# EasyEDA Pro project ProPrj_mykeyboard_2025-10-05.epro

# Schematic Schematic1

## Sheets
1 P1: Board Name: Board1; Create Date: 2025-10-05; Page Name: P1; Project Name: mykeyboard; Schematic Name: Schematic1; Update Date: 2025-10-05; Company: 嘉立创EDA; Page Size: A4; Version: V1.0
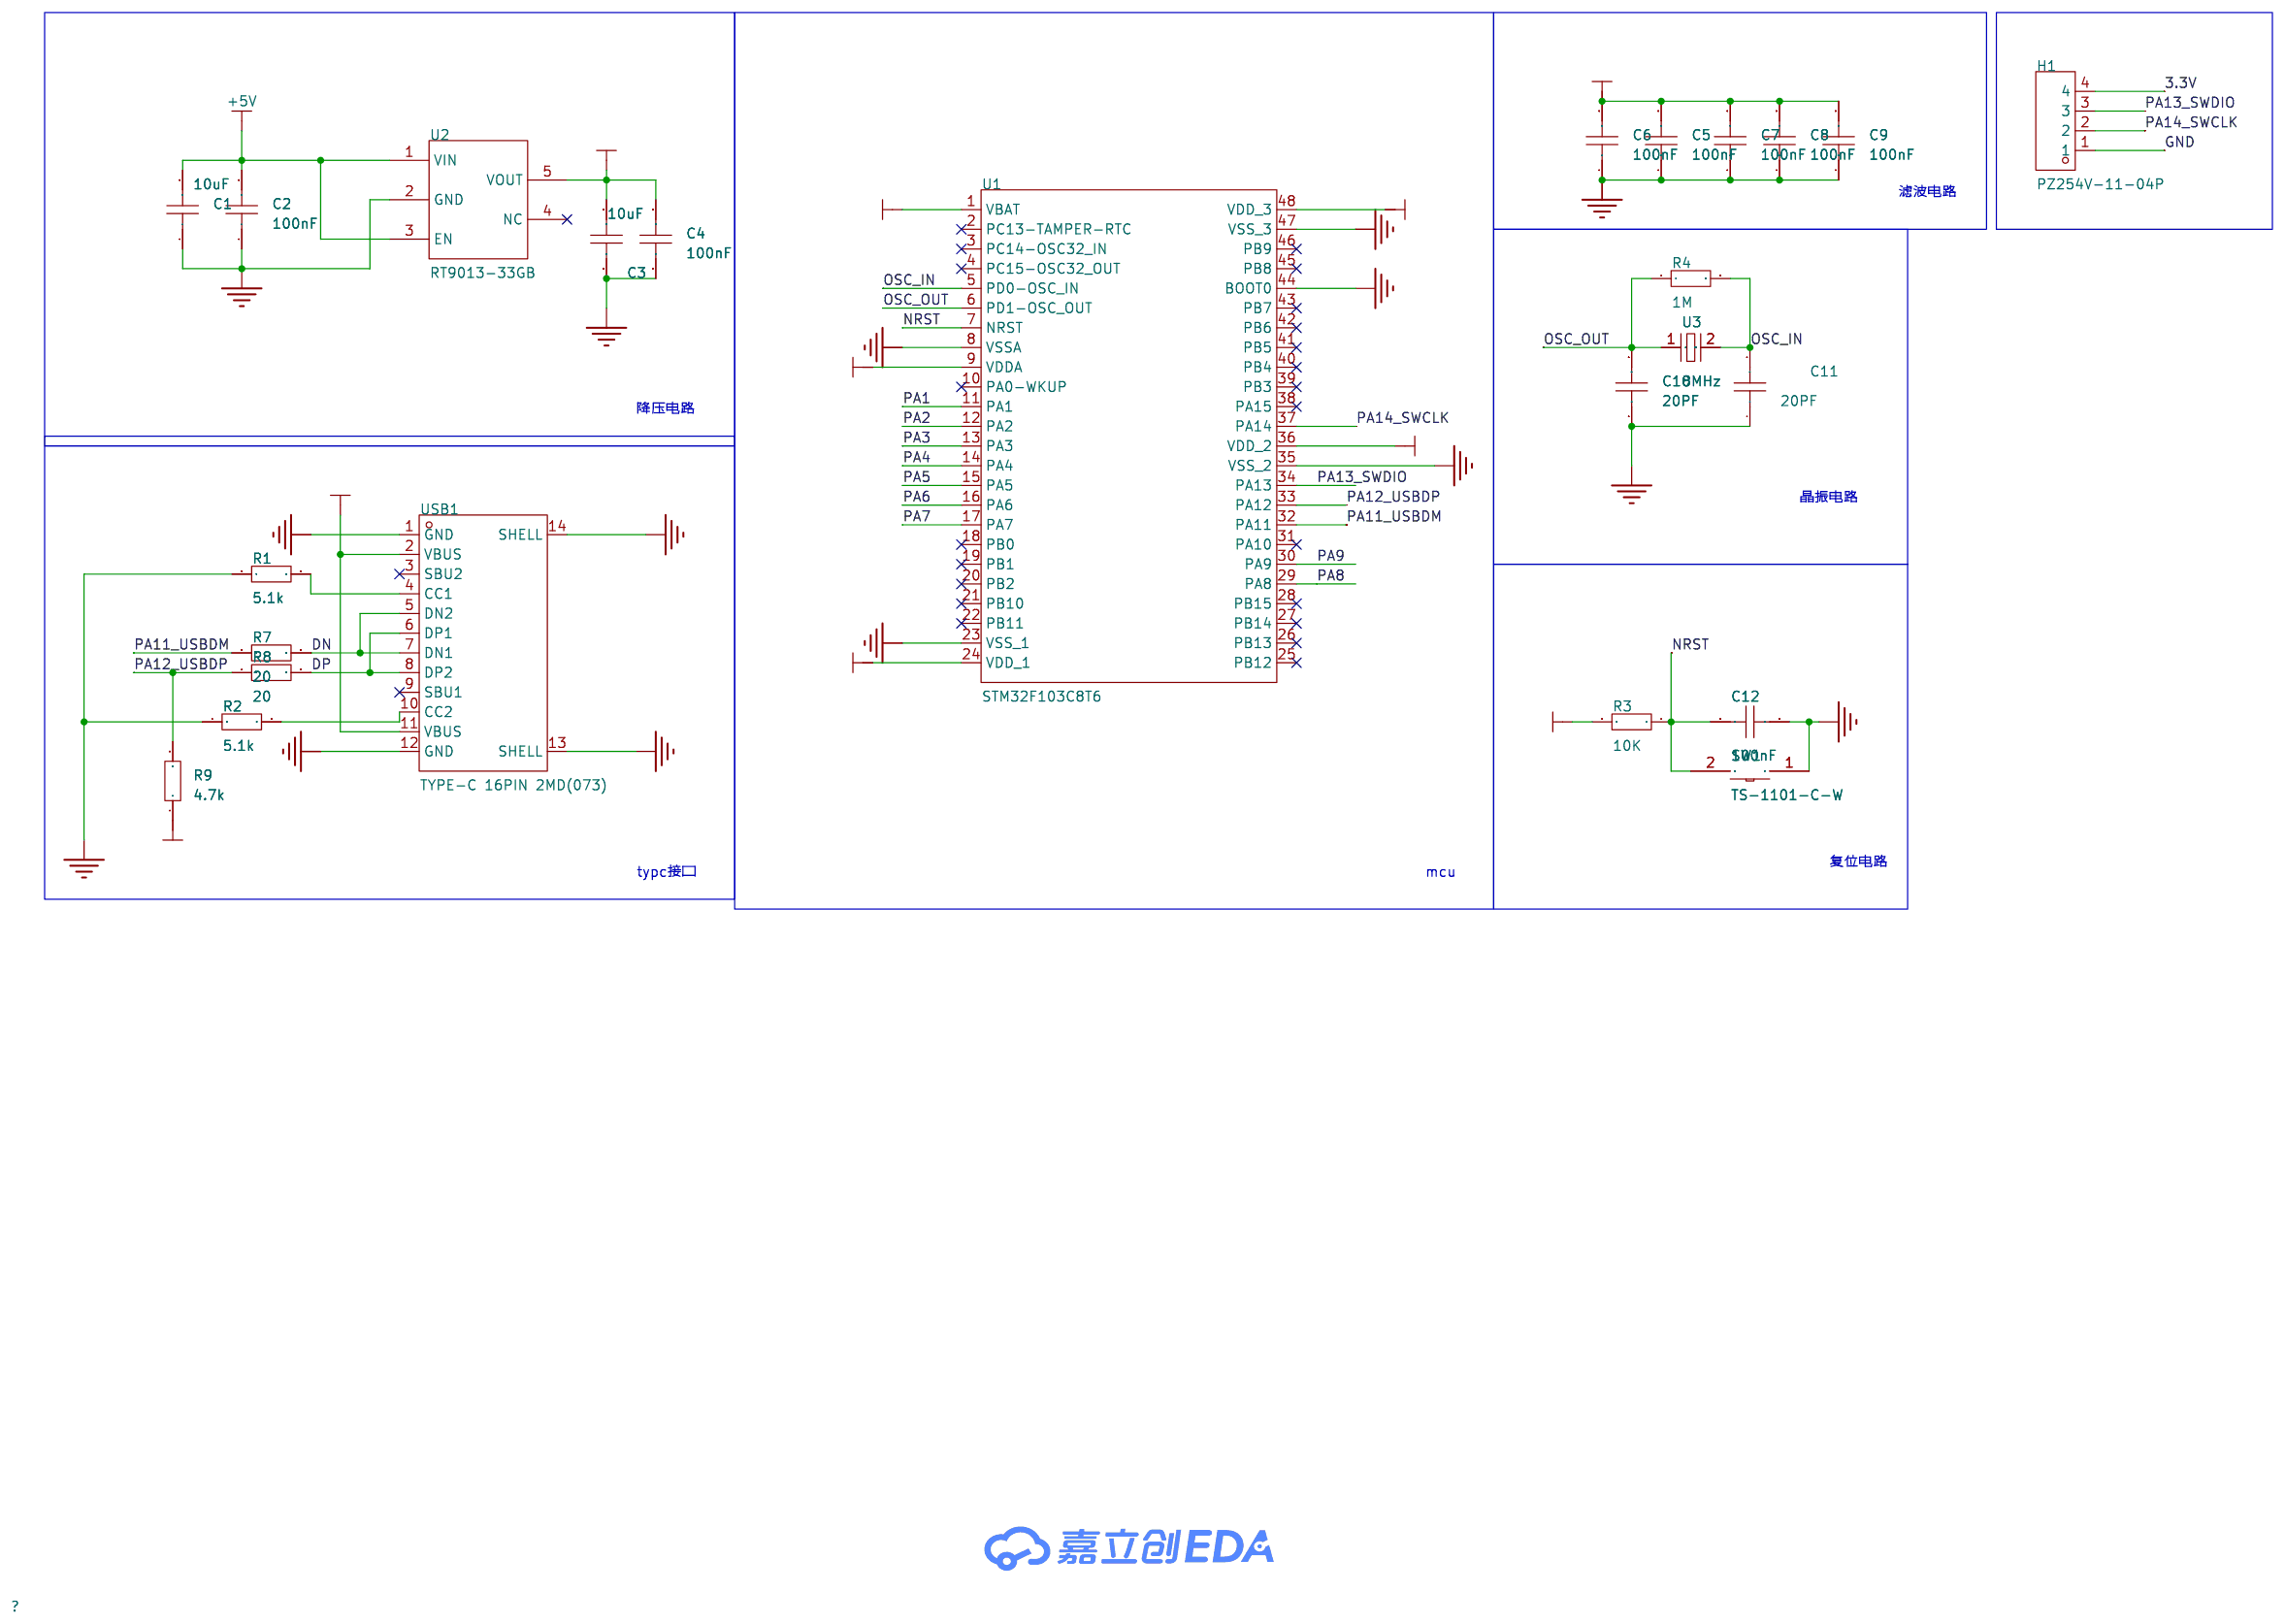
[diagram p0: P1]
2 P2: Page Name: P2
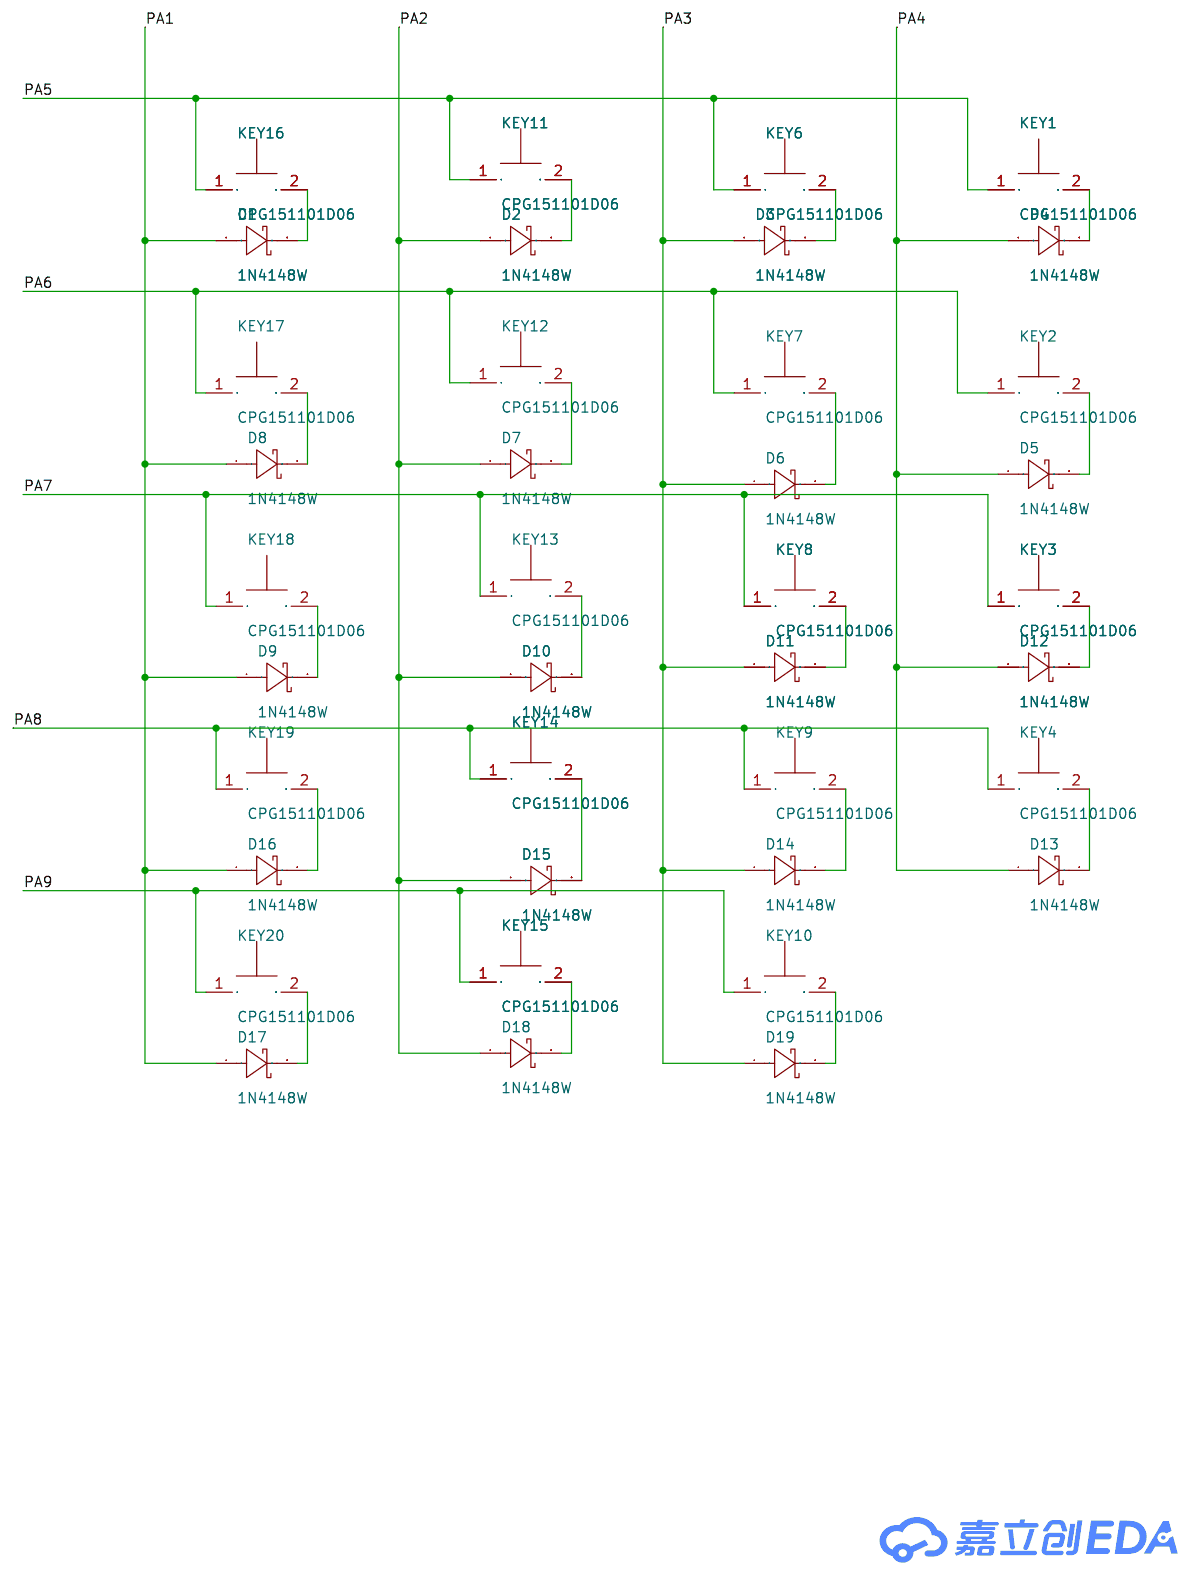
[diagram p1: P2]

## Parts
sheet P1
C1  10uF  [C0603]
C2  100nF  [C0603]
C3  10uF  [C0603]
C4  100nF  [C0603]
C5  100nF  [C0603]
C6  100nF  [C0603]
C7  100nF  [C0603]
C8  100nF  [C0603]
C9  100nF  [C0603]
C10  20PF  [C0603]
C11  20PF  [C0603]
C12  100nF  [C0603]
H1  PZ254V-11-04P  [HDR-TH_4P-P2.54-V-M]
R1  5.1k  [R0603]
R2  5.1k  [R0603]
R3  10K  [R0603]
R4  1M  [R0603]
R7  20  [R0603]
R8  20  [R0603]
R9  4.7k  [R0603]
SW1  TS-1101-C-W  [SW-SMD_L6.0-W3.3-LS8.0]
U1  STM32F103C8T6  [LQFP-48_L7.0-W7.0-P0.50-LS9.0-BL]
U2  RT9013-33GB  [SOT-23-5_L3.0-W1.7-P0.95-LS2.8-BL]
U3  8MHz  [HC-49S_L7.0-W4.0]
USB1  TYPE-C 16PIN 2MD(073)  [USB-C-SMD_TYPE-C-6PIN-2MD-073]
sheet P2
D1  1N4148W  [SOD-123_L2.7-W1.6-LS3.7-FD]
D2  1N4148W  [SOD-123_L2.7-W1.6-LS3.7-FD]
D3  1N4148W  [SOD-123_L2.7-W1.6-LS3.7-FD]
D4  1N4148W  [SOD-123_L2.7-W1.6-LS3.7-FD]
D5  1N4148W  [SOD-123_L2.7-W1.6-LS3.7-FD]
D6  1N4148W  [SOD-123_L2.7-W1.6-LS3.7-FD]
D7  1N4148W  [SOD-123_L2.7-W1.6-LS3.7-FD]
D8  1N4148W  [SOD-123_L2.7-W1.6-LS3.7-FD]
D9  1N4148W  [SOD-123_L2.7-W1.6-LS3.7-FD]
D10  1N4148W  [SOD-123_L2.7-W1.6-LS3.7-FD]
D11  1N4148W  [SOD-123_L2.7-W1.6-LS3.7-FD]
D12  1N4148W  [SOD-123_L2.7-W1.6-LS3.7-FD]
D13  1N4148W  [SOD-123_L2.7-W1.6-LS3.7-FD]
D14  1N4148W  [SOD-123_L2.7-W1.6-LS3.7-FD]
D15  1N4148W  [SOD-123_L2.7-W1.6-LS3.7-FD]
D16  1N4148W  [SOD-123_L2.7-W1.6-LS3.7-FD]
D17  1N4148W  [SOD-123_L2.7-W1.6-LS3.7-FD]
D18  1N4148W  [SOD-123_L2.7-W1.6-LS3.7-FD]
D19  1N4148W  [SOD-123_L2.7-W1.6-LS3.7-FD]
KEY1  CPG151101D06  [KEY-TH_CPG151101D06]
KEY2  CPG151101D06  [KEY-TH_CPG151101D06]
KEY3  CPG151101D06  [KEY-TH_CPG151101D06]
KEY4  CPG151101D06  [KEY-TH_CPG151101D06]
KEY6  CPG151101D06  [KEY-TH_CPG151101D06]
KEY7  CPG151101D06  [KEY-TH_CPG151101D06]
KEY8  CPG151101D06  [KEY-TH_CPG151101D06]
KEY9  CPG151101D06  [KEY-TH_CPG151101D06]
KEY10  CPG151101D06  [KEY-TH_CPG151101D06]
KEY11  CPG151101D06  [KEY-TH_CPG151101D06]
KEY12  CPG151101D06  [KEY-TH_CPG151101D06]
KEY13  CPG151101D06  [KEY-TH_CPG151101D06]
KEY14  CPG151101D06  [KEY-TH_CPG151101D06]
KEY15  CPG151101D06  [KEY-TH_CPG151101D06]
KEY16  CPG151101D06  [KEY-TH_CPG151101D06]
KEY17  CPG151101D06  [KEY-TH_CPG151101D06]
KEY18  CPG151101D06  [KEY-TH_CPG151101D06]
KEY19  CPG151101D06  [KEY-TH_CPG151101D06]
KEY20  CPG151101D06  [KEY-TH_CPG151101D06]

## Library data of the parts
C1-C12 = CAP_0603: Supplier Footprint: 0603
H1 = PZ254V-11-04P: 插针结构:1x4P;间距:2.54mm;行距:-;圆针/方针:方针;安装方式:直插;排数:单排;总PIN位数:4P;额定电流:3A;额定电压:250V;配合针长度:6mm;塑高:2.5mm;端接针长度:3mm;触头材质:-;工作温度:-40℃~+105℃;颜色:黑色;; LCSC Part Name: 1x4P 间距:2.54mm 方针 直插; Supplier Part: C2691448; Manufacturer: XFCN(兴飞); Supplier Footprint: 插件,P=2.54mm; JLCPCB Part Class: 扩展库; Datasheet: https://item.szlcsc.com/datasheet/PZ254V-11-04P/2801085.html; Supplier: LCSC; Pin Structure: 1x4P; Pitch: 2.54mm; Circluar Pins/Square Pins: 方针; Mounting Type: 直插; Number of Rows: 单排; Number of Pins: 4P; Current Rating: 3A; Voltage Rating (Max): 250V; Length of Mating Pin: 6mm; Insulation Height: 2.5mm; Length of End Connection Pin: 3mm; Operating Temperature: -40℃~+105℃; Color: 黑色
R1-R4 R7-R9 = Res_0603: Supplier Footprint: 0603
SW1 = TS-1101-C-W: 电路结构:单刀单掷;按钮形状:矩形按钮;作用力:260gf;安装方式:立贴;开关长度:6mm;开关宽度:3.6mm;开关高度:2.5mm;带支架:不带;触点电流:50mA;额定电压(AC):-;额定电压(DC):12V;额定功率:-;绝缘电阻:-;带灯:无;机械寿命:5万次;; LCSC Part Name: 6*3.6*2.5mm 立贴 轻触开关; Supplier Part: C318938; Manufacturer: XKB Connectivity(中国星坤); Supplier Footprint: SMD; JLCPCB Part Class: 扩展库; Datasheet: https://atta.szlcsc.com/upload/public/pdf/source/20200227/C318938_C2E53B1EEDE37D980A33616AC086DE53.pdf; Supplier: LCSC; Circuit: 单刀单掷; Actuator Style: 矩形按钮; Operating Force: 260gf; Mounting Style: 立贴; Switch Length: 6mm; Switch Width: 3.6mm; Switch Height: 2.5mm; Strike Gundam: 不带; Contact Current: 50mA; Voltage Rating (DC): 12V; Actuator/Cap Color: 白色带淡绿; With Lamp: 无; Mechanical Life: 5万次; Operating Temperature: -30℃~+85℃
U1 = STM32F103C8T6: CPU内核:ARM-M3;CPU最大主频:72MHz;应用领域:-;; LCSC Part Name: 主流增强型ARM Cortex-M3 MCU，具有64 KB Flash、72 MHz CPU、电机控制、USB和CAN; Supplier Part: C8734; Manufacturer: ST(意法半导体); Supplier Footprint: LQFP-48(7x7); JLCPCB Part Class: 扩展库; Datasheet: https://item.szlcsc.com/datasheet/STM32F103C8T6/9243.html; Supplier: LCSC; CPU Core: ARM-M3; CPU Maximum Speed: 72MHz; Program Storage Size: 64KB; Program Memory Type: FLASH; Number of I/O: 37; ADC (Bit): 12bit; Voltage - Supply: 2V~3.6V
U2 = RT9013-33GB: 输出类型:固定;工作电压:5.5V;输出电压:3.3V;输出电流:500mA;电源纹波抑制比(PSRR):50dB@(10kHz);输出极性:正极;; LCSC Part Name: 输入5.5V 输出3.3V 500mA; Supplier Part: C47773; Manufacturer: RICHTEK(立锜); Supplier Footprint: SOT-23-5; JLCPCB Part Class: 扩展库; Datasheet: https://item.szlcsc.com/datasheet/RT9013-33GB/48778.html; Supplier: LCSC; Output Type: 固定; Voltage - Supply: 5.5V; Output Voltage: 3.3V; Output Current: 500mA; Power Supply Rejection Ratio (PSRR): 50dB@(10kHz); Voltage Dropout: 400mV@(500mA); standby current: 25uA; Noise: 30uVrms; Features: 带使能；过热保护；过流保护; Operating Temperature: -40℃~+125℃@(Tj); Output Configuration: 正极; Number of Outputs: 1
U3 = 8M 20PF 20PPM: 频率:8MHz;常温频差:±20ppm;负载电容:20pF;频率稳定度:±30ppm;; LCSC Part Name: 8MHz ±20ppm 20pF; Supplier Part: C5289692; Manufacturer: SOSET(索斯特); Supplier Footprint: HC-49S-SMD-Mini; JLCPCB Part Class: 扩展库; Datasheet: https://item.szlcsc.com/datasheet/8M%252020PF%252020PPM/6029008.html; Supplier: LCSC; Normal temperature Frequency Tolerance: ±20ppm; Load Capacitance: 20pF; Frequency Stability: ±30ppm; Operating Temperature: -20℃~+70℃
USB1 = TYPE-C 16PIN 2MD(073): 连接器类型:Type-C;协议标准:-;公母:母;安装方式:卧贴;触点数量:16P;端口数量:1;额定电流 - 电源:3A;工作温度:-25℃~+85℃;; LCSC Part Name: Type-C 母 卧贴; Supplier Part: C2765186; Manufacturer: SHOU HAN(首韩); Supplier Footprint: SMD; JLCPCB Part Class: 扩展库; Datasheet: https://item.szlcsc.com/datasheet/TYPE-C%252016PIN%25202MD(073)/2901843.html; Supplier: LCSC; Connector Type: Type-C; Gender: 母; Mounting Type: 卧贴; Number of Contacts: 16P; Number of Ports: 1; Current Rating-Power: 3A; Voltage Rating: 5V; Connect-Disconnect Life: 5千次; Detection color: 黑色; Operating Temperature: -25℃~+85℃
D1-D19 = 1N4148W_C7420318: 二极管配置:独立式;正向压降(Vf):1.25V@150mA;直流反向耐压(Vr):100V;整流电流:150mA;反向恢复时间(Trr):4ns;; Supplier Part: C7420318; Manufacturer: R+O(宏嘉诚); Supplier Footprint: SOD-123; JLCPCB Part Class: 扩展库; Datasheet: https://item.szlcsc.com/datasheet/1N4148W/8397140.html; Supplier: LCSC; Diode Configuration: 独立式; Voltage - Forward(Vf@If): 1.25V@150mA; Voltage - DC Reverse(Vr): 100V; Current - Rectified: 150mA; Pd - Power Dissipation: 400mW; Reverse Leakage Current (Ir): 1uA@75V; Reverse Recovery Time (trr): 4ns; Operating Junction Temperature Range: -55℃~+150℃; Non-Repetitive Peak Forward Surge Current: 2A
KEY1-KEY4 KEY6-KEY20 = CPG151101D06: 机械键盘开关MX茶轴 段落手感; Supplier Part: C49234237; Manufacturer: HanElectricity(瀚源); Supplier Footprint: 插件; JLCPCB Part Class: 扩展库; Datasheet: https://atta.szlcsc.com/upload/public/pdf/source/20250618/1ECA712F36A194FE51736216F4B8819D.pdf; Supplier: LCSC

## Nets
3.3V: C3.2 C4.2 C5.2 C6.2 C7.2 C8.2 C9.2 H1.4 R3.2 R9.1 U1.1(VBAT) U1.9(VDDA) U1.24(VDD_1) U1.36(VDD_2) U1.48(VDD_3) U2.5(VOUT)
+5V: C1.2 C2.2 U2.1(VIN) U2.3(EN) USB1.2(VBUS) USB1.11(VBUS)
GND: C1.1 C2.1 C3.1 C4.1 C5.1 C6.1 C7.1 C8.1 C9.1 C10.1 C11.1 C12.1 H1.1 R1.1 R2.1 SW1.1 U1.8(VSSA) U1.23(VSS_1) U1.35(VSS_2) U1.44(BOOT0) U1.47(VSS_3) U2.2(GND) USB1.1(GND) USB1.12(GND) USB1.13(SHELL) USB1.14(SHELL)
DN: R7.2 USB1.5(DN2) USB1.7(DN1)
DP: R8.2 USB1.6(DP1) USB1.8(DP2)
NRST: C12.2 R3.1 SW1.2 U1.7(NRST)
OSC_IN: C11.2 R4.2 U1.5(PD0-OSC_IN) U3.2(GND)
OSC_OUT: C10.2 R4.1 U1.6(PD1-OSC_OUT) U3.1
PA1: D1.1(A) D8.1(A) D9.1(A) D16.1(A) D17.1(A) U1.11(PA1)
PA2: D2.1(A) D7.1(A) D10.1(A) D15.1(A) D18.1(A) U1.12(PA2)
PA3: D3.1(A) D6.1(A) D11.1(A) D14.1(A) D19.1(A) U1.13(PA3)
PA4: D4.1(A) D5.1(A) D12.1(A) D13.1(A) U1.14(PA4)
PA5: KEY1.1 KEY6.1 KEY11.1 KEY16.1 U1.15(PA5)
PA6: KEY2.1 KEY7.1 KEY12.1 KEY17.1 U1.16(PA6)
PA7: KEY3.1 KEY8.1 KEY13.1 KEY18.1 U1.17(PA7)
PA8: KEY4.1 KEY9.1 KEY14.1 KEY19.1 U1.29(PA8)
PA9: KEY10.1 KEY15.1 KEY20.1 U1.30(PA9)
PA11_USBDM: R7.1 U1.32(PA11)
PA12_USBDP: R8.1 R9.2 U1.33(PA12)
PA13_SWDIO: H1.3 U1.34(PA13)
PA14_SWCLK: H1.2 U1.37(PA14)
$1N879: R2.2 USB1.10(CC2)
$1N949: R1.2 USB1.4(CC1)
$2N2321: D1.2(K) KEY16.2
$2N2416: D8.2(K) KEY17.2
$2N2432: D7.2(K) KEY12.2
$2N2438: D2.2(K) KEY11.2
$2N2444: D3.2(K) KEY6.2
$2N2450: D4.2(K) KEY1.2
$2N2455: D5.2(K) KEY2.2
$2N2482: D6.2(K) KEY7.2
$2N2538: D9.2(K) KEY18.2
$2N2571: D10.2(K) KEY13.2
$2N2603: D11.2(K) KEY8.2
$2N2624: D12.2(K) KEY3.2
$2N2648: D13.2(K) KEY4.2
$2N2677: D14.2(K) KEY9.2
$2N2714: D15.2(K) KEY14.2
$2N2748: D16.2(K) KEY19.2
$2N2794: D19.2(K) KEY10.2
$2N2817: D18.2(K) KEY15.2
$2N2829: D17.2(K) KEY20.2

Not connected (* = marked no-connect by the designer): U1 2(PC13-TAMPER-RTC)* 3(PC14-OSC32_IN)* 4(PC15-OSC32_OUT)* 10(PA0-WKUP)* 18(PB0)* 19(PB1)* 20(PB2)* 21(PB10)* 22(PB11)* 25(PB12)* 26(PB13)* 27(PB14)* 28(PB15)* 31(PA10)* 38(PA15)* 39(PB3)* 40(PB4)* 41(PB5)* 42(PB6)* 43(PB7)* 45(PB8)* 46(PB9)*; U2 4(NC)*; USB1 3(SBU2)* 9(SBU1)*

## Notes on the sheets
sheet 1
- 滤波电路
- 降压电路
- 晶振电路
- typc接口
- mcu
- 复位电路

# Board PCB4
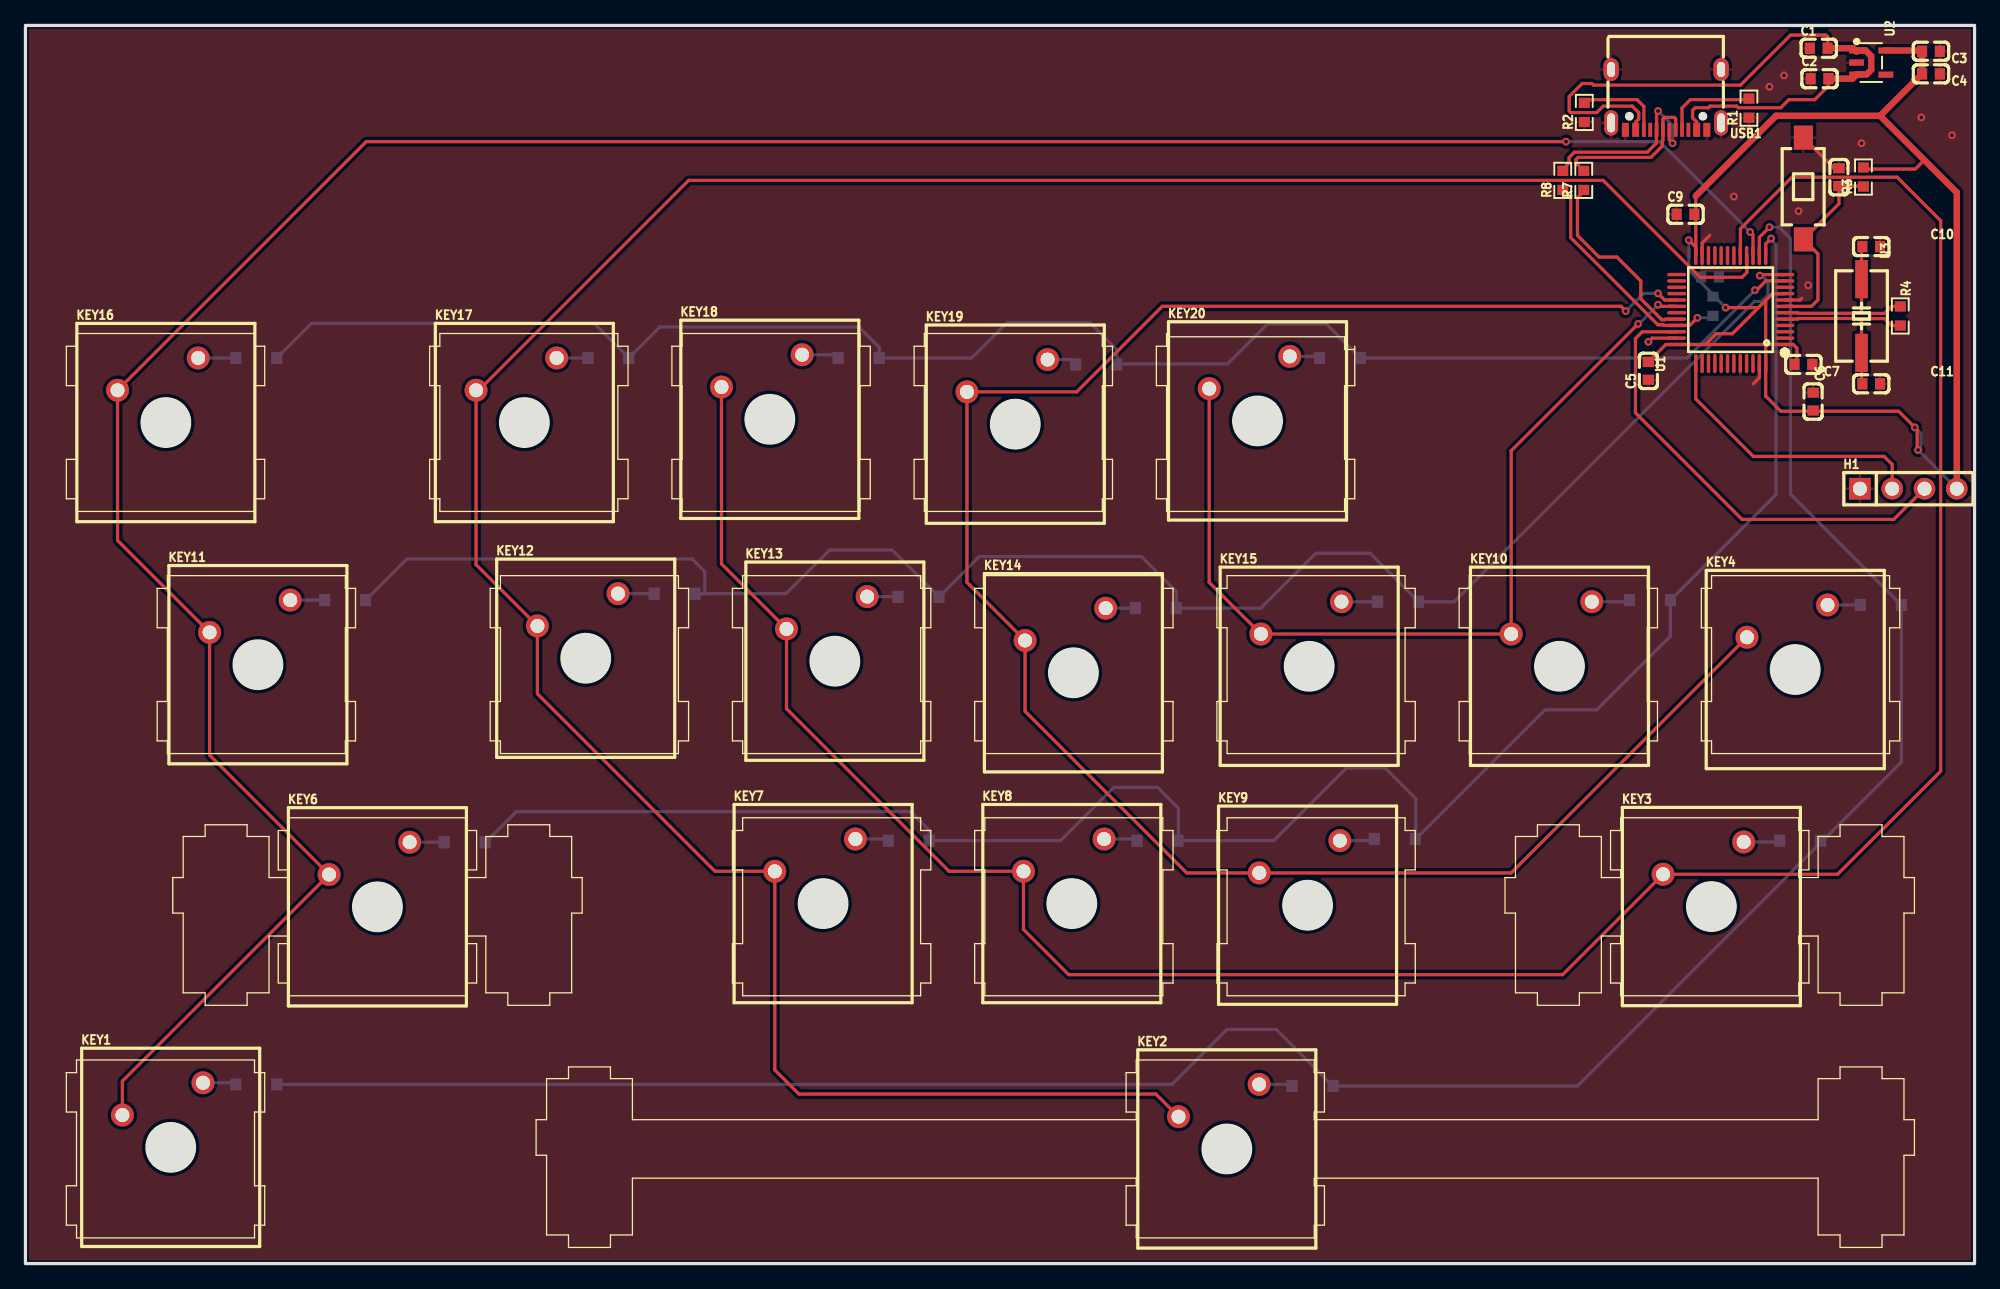
[diagram p2: board, top side]
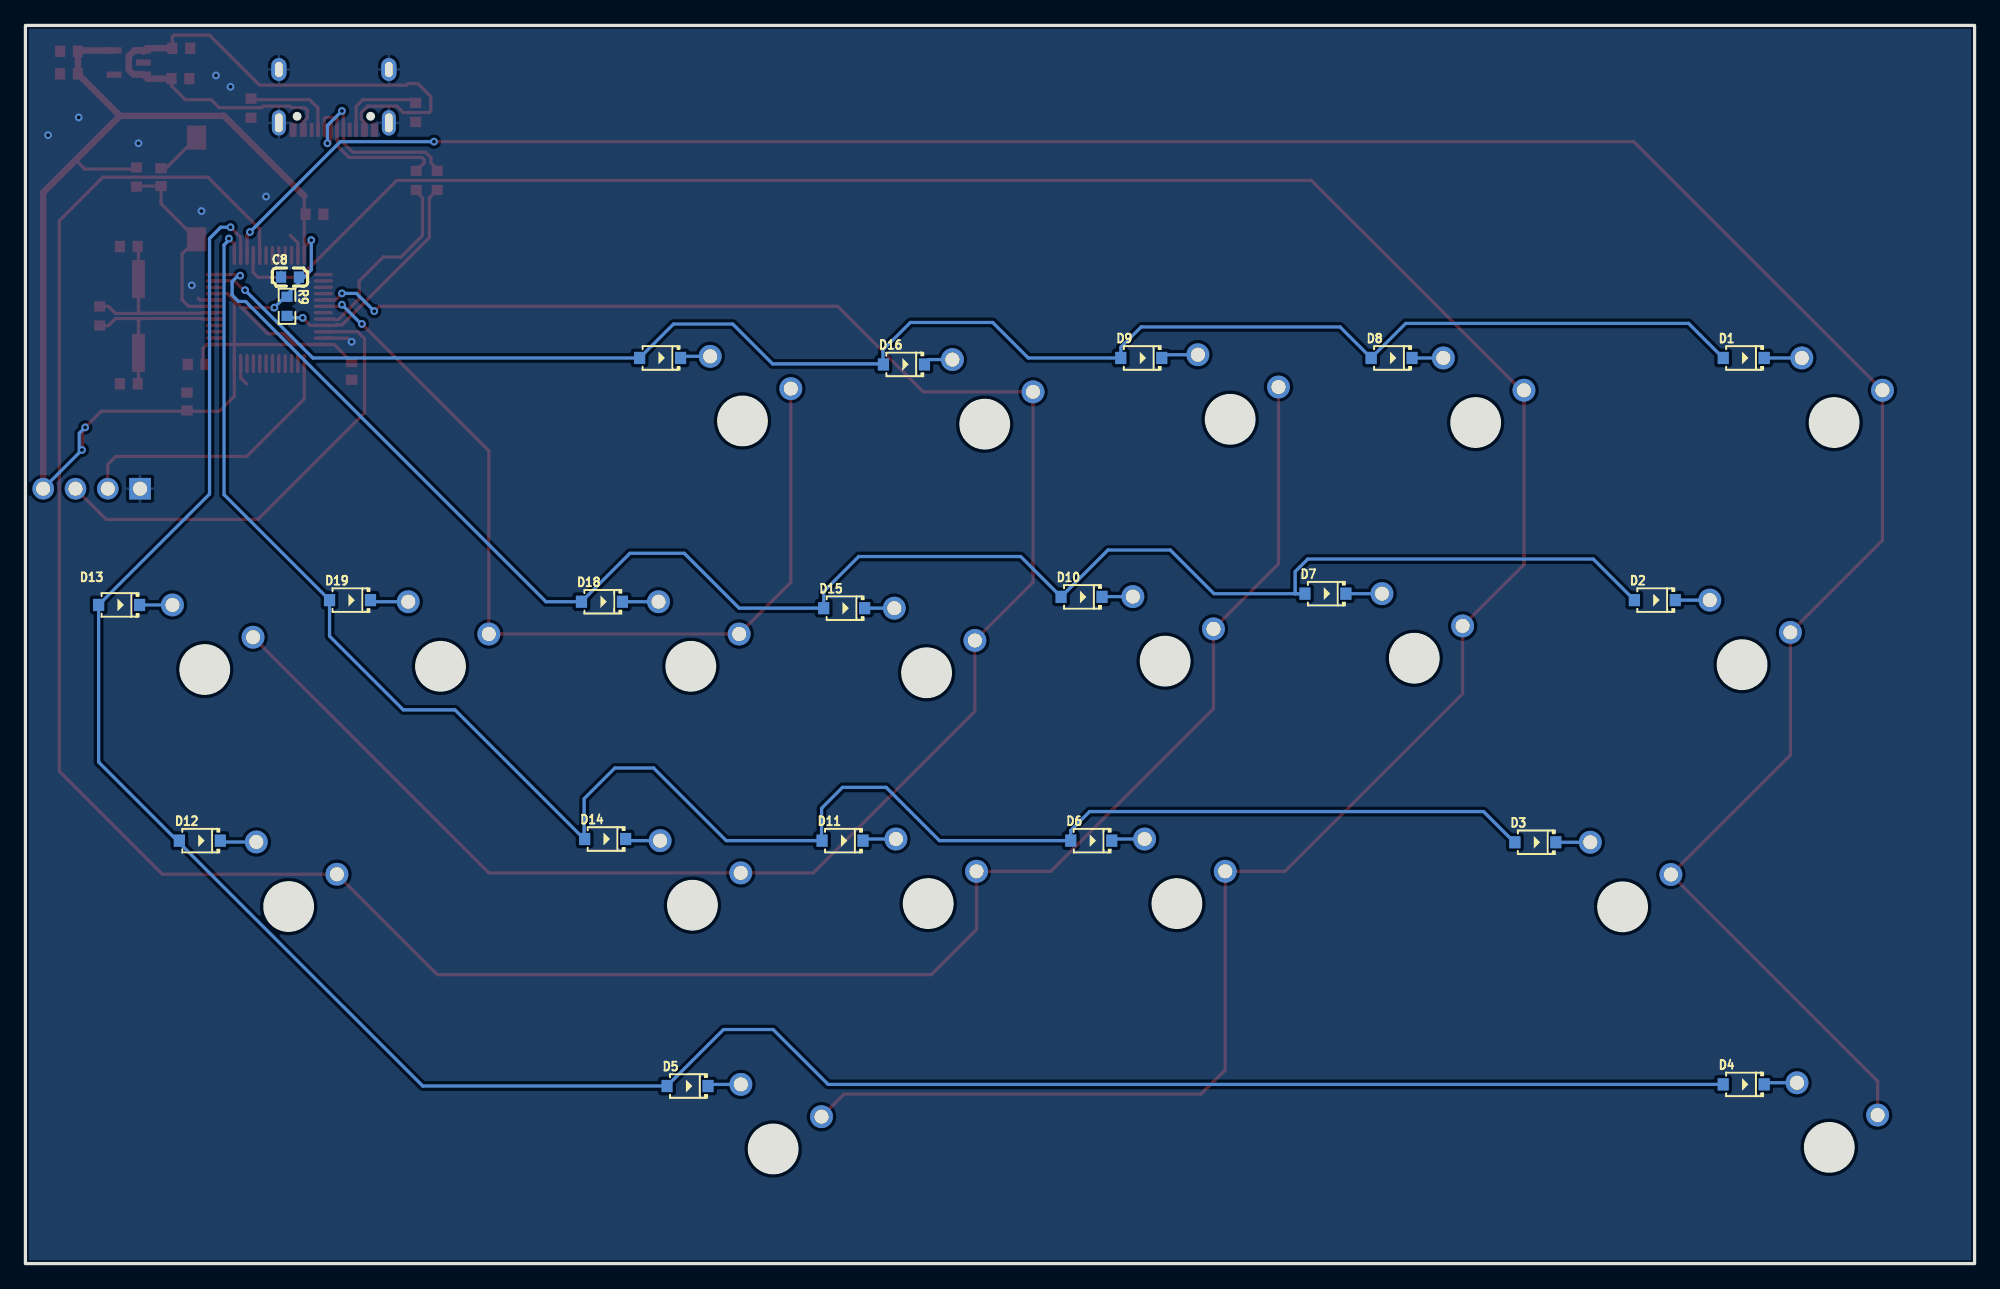
[diagram p3: board, bottom side, seen from below]

Outline 153.29 x 97.41 mm; copper layers: Top Layer, Bottom Layer. Coordinates in mm from the lower left corner of the outline.
Outline path: rectangle 0,97.41 153.29,0
Stack: Top Layer 0.035mm / Dielectric1 1.51mm FR4 er 4.5 / Bottom Layer 0.035mm

## Design rules (mm)
net OSC_OUT: DP1
net OSC_IN: DP1
net DN: DP2
net PA11_USBDM: DP3
net DP: DP2
net PA12_USBDP: DP3
template: JLCPCB Capability(Two Layers Board)
spacing copperThickness1oz (default): track to track 0.102, other pairs 0.152 to 0.3
spacing copperThickness2oz: track to track 0.203, other pairs 0.152 to 0.3
track width copperThickness1oz (default): min 0.127, default 0.254, max 2.54
track width copperThickness2oz: min 0.203, default 0.254, max 2.54
differential pair differentialPair (default): width min 0.127, default 0.254, max 2.54; gap min 0.152, default 0.152
via viaSize (default): diameter min 0.5, default 0.61, max 10; hole min 0.3, default 0.305, max 6.3

## Placement (name value [footprint] x y rotation side)
C1  10uF  [C0603]  141.03 95.61 0 top
C2  100nF  [C0603]  141.1 93.22 0 top
C3  10uF  [C0603]  149.86 95.38 180 top
C4  100nF  [C0603]  149.86 93.6 180 top
C5  100nF  [C0603]  127.63 70.23 90 top
C6  100nF  [C0603]  140.59 67.82 270 top
C7  100nF  [C0603]  139.83 70.74 180 top
C8  100nF  [C0603]  132.48 77.61 180 bottom
C9  100nF  [C0603]  130.56 82.55 0 top
C10  20PF  [C0603]  145.16 80.01 180 top
C11  20PF  [C0603]  145.16 69.22 180 top
C12  100nF  [C0603]  142.62 85.47 270 top
D1  1N4148W  [SOD-123_L2.7-W1.6-LS3.7-FD]  18.16 71.25 180 bottom
D2  1N4148W  [SOD-123_L2.7-W1.6-LS3.7-FD]  25.15 52.2 180 bottom
D3  1N4148W  [SOD-123_L2.7-W1.6-LS3.7-FD]  34.54 33.15 180 bottom
D4  1N4148W  [SOD-123_L2.7-W1.6-LS3.7-FD]  18.16 14.1 180 bottom
D5  1N4148W  [SOD-123_L2.7-W1.6-LS3.7-FD]  101.22 13.97 180 bottom
D6  1N4148W  [SOD-123_L2.7-W1.6-LS3.7-FD]  69.47 33.27 180 bottom
D7  1N4148W  [SOD-123_L2.7-W1.6-LS3.7-FD]  51.05 52.71 180 bottom
D8  1N4148W  [SOD-123_L2.7-W1.6-LS3.7-FD]  45.85 71.25 180 bottom
D9  1N4148W  [SOD-123_L2.7-W1.6-LS3.7-FD]  65.53 71.25 180 bottom
D10  1N4148W  [SOD-123_L2.7-W1.6-LS3.7-FD]  70.23 52.45 180 bottom
D11  1N4148W  [SOD-123_L2.7-W1.6-LS3.7-FD]  89.03 33.27 180 bottom
D12  1N4148W  [SOD-123_L2.7-W1.6-LS3.7-FD]  139.57 33.27 180 bottom
D13  1N4148W  [SOD-123_L2.7-W1.6-LS3.7-FD]  145.92 51.82 180 bottom
D14  1N4148W  [SOD-123_L2.7-W1.6-LS3.7-FD]  107.7 33.4 180 bottom
D15  1N4148W  [SOD-123_L2.7-W1.6-LS3.7-FD]  88.9 51.56 180 bottom
D16  1N4148W  [SOD-123_L2.7-W1.6-LS3.7-FD]  84.2 70.74 180 bottom
D17  1N4148W  [SOD-123_L2.7-W1.6-LS3.7-FD]  103.38 71.25 180 bottom
D18  1N4148W  [SOD-123_L2.7-W1.6-LS3.7-FD]  107.95 52.07 180 bottom
D19  1N4148W  [SOD-123_L2.7-W1.6-LS3.7-FD]  127.76 52.2 180 bottom
H1  PZ254V-11-04P  [HDR-TH_4P-P2.54-V-M]  148.08 60.96 0 top
KEY1  CPG151101D06  [KEY-TH_CPG151101D06]  10.8 12.95 0 top
KEY2  CPG151101D06  [KEY-TH_CPG151101D06]  93.85 12.83 0 top
KEY3  CPG151101D06  [KEY-TH_CPG151101D06]  131.96 31.9 0 top
KEY4  CPG151101D06  [KEY-TH_CPG151101D06]  138.56 50.55 0 top
KEY6  CPG151101D06  [KEY-TH_CPG151101D06]  27.05 31.88 0 top
KEY7  CPG151101D06  [KEY-TH_CPG151101D06]  62.1 32.13 0 top
KEY8  CPG151101D06  [KEY-TH_CPG151101D06]  81.66 32.13 0 top
KEY9  CPG151101D06  [KEY-TH_CPG151101D06]  100.2 32 0 top
KEY10  CPG151101D06  [KEY-TH_CPG151101D06]  120.02 50.8 0 top
KEY11  CPG151101D06  [KEY-TH_CPG151101D06]  17.65 50.93 0 top
KEY12  CPG151101D06  [KEY-TH_CPG151101D06]  43.43 51.44 0 top
KEY13  CPG151101D06  [KEY-TH_CPG151101D06]  63.03 51.2 0 top
KEY14  CPG151101D06  [KEY-TH_CPG151101D06]  81.79 50.29 0 top
KEY15  CPG151101D06  [KEY-TH_CPG151101D06]  100.33 50.8 0 top
KEY16  CPG151101D06  [KEY-TH_CPG151101D06]  10.41 69.98 0 top
KEY17  CPG151101D06  [KEY-TH_CPG151101D06]  38.61 69.98 0 top
KEY18  CPG151101D06  [KEY-TH_CPG151101D06]  57.91 70.23 0 top
KEY19  CPG151101D06  [KEY-TH_CPG151101D06]  77.22 69.85 0 top
KEY20  CPG151101D06  [KEY-TH_CPG151101D06]  96.27 70.1 0 top
R1  5.1k  [R0603]  135.55 90.9 90 top
R2  5.1k  [R0603]  122.6 90.56 90 top
R3  10K  [R0603]  144.55 85.48 90 top
R4  1M  [R0603]  147.45 74.55 270 top
R7  20  [R0603]  122.56 85.22 90 top
R8  20  [R0603]  120.9 85.22 90 top
R9  4.7k  [R0603]  132.72 75.31 270 bottom
SW1  TS-1101-C-W  [SW-SMD_L6.0-W3.3-LS8.0]  139.83 84.58 270 top
U1  STM32F103C8T6  [LQFP-48_L7.0-W7.0-P0.50-LS9.0-BL]  134.11 75.06 90 top
U2  RT9013-33GB  [SOT-23-5_L3.0-W1.7-P0.95-LS2.8-BL]  145.16 94.49 270 top
U3  8MHz  [HC-49S_L7.0-W4.0]  144.4 74.55 270 top
USB1  TYPE-C 16PIN 2MD(073)  [USB-C-SMD_TYPE-C-6PIN-2MD-073]  129.03 91.57 180 top

## Footprints (pads in the part's own frame, mm; a bottom-side part is the same pattern mirrored in y, then rotated)
C0603
  rect 0.8x0.9 smd: 1(-0.7,0) 2(0.7,0)
HC-49S_L7.0-W4.0
  rect 3x1 smd: 1(-2.9,0) 2(2.9,0)
HDR-TH_4P-P2.54-V-M
  rect 1.7x1.7 hole 1.1: 1(-3.81,0)
  round 1.7 hole 1.1: 2(-1.27,0) 3(1.27,0) 4(3.81,0)
KEY-TH_CPG151101D06
  round 1.8 hole 1.1: 1(-3.17,-1.27) 2(3.17,1.27)
LQFP-48_L7.0-W7.0-P0.50-LS9.0-BL
  oval 0.27x1.5 smd: 1(-2.75,-4.25) 2(-2.25,-4.25) 3(-1.75,-4.25) 4(-1.25,-4.25) 5(-0.75,-4.25) 6(-0.25,-4.25) 7(0.25,-4.25) 8(0.75,-4.25) 9(1.25,-4.25) 10(1.75,-4.25) 11(2.25,-4.25) 12(2.75,-4.25) 25(2.75,4.25) 26(2.25,4.25) 27(1.75,4.25) 28(1.25,4.25) 29(0.75,4.25) 30(0.25,4.25) 31(-0.25,4.25) 32(-0.75,4.25) 33(-1.25,4.25) 34(-1.75,4.25) 35(-2.25,4.25) 36(-2.75,4.25)
  oval 1.5x0.27 smd: 13(4.25,-2.75) 14(4.25,-2.25) 15(4.25,-1.75) 16(4.25,-1.25) 17(4.25,-0.75) 18(4.25,-0.25) 19(4.25,0.25) 20(4.25,0.75) 21(4.25,1.25) 22(4.25,1.75) 23(4.25,2.25) 24(4.25,2.75) 37(-4.25,2.75) 38(-4.25,2.25) 39(-4.25,1.75) 40(-4.25,1.25) 41(-4.25,0.75) 42(-4.25,0.25) 43(-4.25,-0.25) 44(-4.25,-0.75) 45(-4.25,-1.25) 46(-4.25,-1.75) 47(-4.25,-2.25) 48(-4.25,-2.75)
R0603
  rect 0.806x0.864 smd: 1(-0.753,0) 2(0.753,0)
SOD-123_L2.7-W1.6-LS3.7-FD
  rect 0.88x0.96 smd: 1(-1.61,0) 2(1.61,0)
SOT-23-5_L3.0-W1.7-P0.95-LS2.8-BL
  rect 0.49x1.157 smd: 1(-0.95,-1.153) 2(0,-1.153) 3(0.95,-1.153)
  rect 0.49x1.175 smd: 4(0.95,1.153) 5(-0.95,1.153)
SW-SMD_L6.0-W3.3-LS8.0
  rect 1.9x1.5 smd: 1(-4,0) 2(4,0)
USB-C-SMD_TYPE-C-6PIN-2MD-073
  rect 0.55x1.1 smd: 1(-3.2,2.375) 2(-2.4,2.375) 11(2.4,2.375) 12(3.2,2.375)
  rect 0.3x1.1 smd: 3(-1.75,2.375) 4(-1.25,2.375) 5(-0.75,2.375) 6(-0.25,2.375) 7(0.25,2.375) 8(0.75,2.375) 9(1.25,2.375) 10(1.75,2.375)
  oval 1.1x2 hole 0.6x1.5: 13(-4.325,1.825) 14(4.325,1.825)
  oval 1.2x1.8 hole 0.6x1.2: 13(-4.325,-2.375) 14(4.325,-2.375)

## Nets
As in the schematic.

Pads without a net: U1 2 3 4 10 18 19 20 21 22 25 26 27 28 31 38 39 40 41 42 43 45 46; U2 4; USB1 3 9

## Via types
v1: diameter 0.61, hole 0.305, Top Layer to Bottom Layer, 26 vias

## Routing (per net, layer and track width the routed paths; a pad name or vN(x,y) marks a point on that pad's centre or on a via; arc(x,y) is an arc through that point)
3.3V: length 129.5
  Top Layer w0.254: C5.2 129.01,72.31 U1.36 136.86,72.31 ; v1(130.81,80.52) 131.36,79.97 U1.24 131.36,83.99 ; 131.7,72.31 132.12,72.31 132.97,73.15 134.24,73.15 136.86,75.78 ; v1(133.71,75.21) 136.12,75.21 136.14,75.18 ; 136.86,75.78 U1.48 136.86,68.24 138.05,67.06 147.32,67.06 v1(148.59,65.79) 148.78,65.6 148.78,64.01 ; 136.86,75.78 137.39,76.31 U1.9 ; 136.77,72.31 U1.1 139.02,72.31 139.32,72.01 139.32,70.93 C7.2 ; 144.55,86.11 148.62,86.11 149.33,86.82
  Top Layer w0.508: 131.36,83.99 137.67,90.3 145.86,90.3 ; 145.86,90.3 C4.2 C3.2 149.1,95.44 U2.5 ; 145.86,90.3 151.89,84.26 H1.4
  Bottom Layer w0.254: v1(130.81,80.52) 130.81,78.17 133.86,75.06 ; 148.72,64.01 v1(148.84,64.01) H1.4 ; v1(148.59,65.79) 149.06,65.32 149.06,63.8
GND: length 11.2
  Top Layer w0.254: v1(127.63,72.52) 127.93,72.81 U1.35 ; 132.46,80.9 131.86,80.3 U1.23 ; U1.47 136.36,69.69 135.89,69.22 ; U1.8 139.56,75.81 139.7,75.95 ; SW1.1 142.24,86.17 C12.1
  vias: v1(134.37,83.95) v1(137.16,92.58) v1(138.3,93.47) v1(139.45,82.8) v1(140.21,76.96) v1(144.4,88.14) v1(149.1,90.17) v1(151.51,88.77)
DN: length 12.5
  Top Layer w0.254: USB1.5 129.78,90.06 129.67,90.17 128.91,90.17 128.78,90.05 USB1.7 128.78,88.39 128.74,88.34 128.74,87.92 127.84,87.03 122.11,87.03 121.93,86.85 121.93,86.59 R7.2
DP: length 15.3
  Top Layer w0.254: v1(128.4,90.68) 128.28,90.56 USB1.8 128.27,89.18 128.27,88.16 127.55,87.43 121.82,87.43 121.4,87.02 121.4,86.59 120.9,86.1 R8.2 ; USB1.6 129.28,88.4 v1(129.54,88.14)
  Bottom Layer w0.254: v1(128.4,90.68) 129.54,89.54 v1(129.54,88.14)
OSC_IN: length 14.7
  Top Layer w0.254: 144.46,69.09 144.4,69.15 144.4,74.17 144.22,74.35 ; 144.22,74.35 146.21,74.35 146.76,73.8 R4.2 ; 144.22,74.35 143.8,74.35 143.79,74.35 139.41,74.35 139.37,74.31 U1.5
OSC_OUT: length 14.7
  Top Layer w0.254: 144.44,80.03 144.4,79.99 U3.1 144.4,74.93 144.22,74.75 ; 144.22,74.75 146.21,74.75 146.76,75.3 R4.1 ; 144.22,74.75 143.97,74.75 143.96,74.76 139.41,74.76 139.37,74.81 U1.6
PA1: length 131.4
  Top Layer w0.254: 136.14,76.58 136.87,77.31 U1.11
  Bottom Layer w0.254: D1.1 22.49,73.97 44.74,73.97 D8.1 49.9,73.69 65.54,73.69 67.14,72.09 D9.1 74.42,71.25 77.22,74.04 83.69,74.04 85.85,71.88 85.85,70.78 ; 85.85,70.78 D16.1 ; 85.85,70.78 94.53,70.78 97.66,73.91 102.32,73.91 D17.1 130.68,71.25 v1(136.02,76.58)
PA2: length 139.2
  Top Layer w0.254: v1(136.4,77.72) 136.48,77.81 U1.12
  Bottom Layer w0.254: D2.1 29.98,55.43 52.44,55.43 53.43,54.44 53.43,52.71 ; 53.43,52.71 53.43,52.71 D7.1 52.67,52.7 53.43,52.71 ; 53.43,52.71 59.82,52.71 63.25,56.13 68.16,56.13 D10.1 75.02,55.63 87.76,55.63 90.51,52.87 D15.1 97.16,51.56 101.47,55.88 105.75,55.88 D18.1 112.35,52.07 135.97,75.69 136.53,75.69 137.03,76.2 137.03,77.26 136.48,77.81
PA3: length 150.3
  Top Layer w0.254: v1(137.29,80.65) 136.86,80.22 U1.13
  Bottom Layer w0.254: 36.09,33.05 38.61,35.56 69.6,35.56 71.08,34.08 D6.1 81.41,33.27 85.6,37.47 89.03,37.47 90.68,35.81 90.68,33.32 90.64,33.27 98.17,33.27 103.89,38.99 106.93,38.99 109.35,36.58 109.35,33.4 119.51,43.56 123.57,43.56 129.37,49.36 D19.1 137.67,60.49 137.67,80.14 137.29,80.52 v1(137.29,80.65)
PA4: length 191.3
  Top Layer w0.254: v1(137.16,81.53) 136.36,80.74 U1.14
  Bottom Layer w0.254: D4.1 90.17,14.1 94.48,18.41 98.39,18.41 D5.1 122.05,13.97 147.53,39.46 D13.1 138.81,60.54 138.81,80.65 137.92,81.53 v1(137.16,81.53)
PA5: length 212
  Top Layer w0.254: KEY1.1 7.62,14.35 KEY6.1 14.48,40.01 KEY11.1 7.24,56.9 KEY16.1 26.8,88.27 v1(121.16,88.27) ; v1(135.64,81.15) 135.86,80.93 U1.15
  Bottom Layer w0.254: v1(121.16,88.27) 128.52,88.27 v1(135.64,81.15)
PA8: length 156.6
  Top Layer w0.254: 73.71,68.58 82.68,68.58 89.41,75.31 125.48,75.31 v1(125.86,74.93) ; KEY19.1 74.05,53.59 KEY14.1 78.62,43.45 91.33,30.73 KEY9.1 116.84,30.73 KEY4.1 ; v1(128.4,76.33) 128.92,75.81 U1.29
  Bottom Layer w0.254: v1(125.86,74.93) 127.25,76.33 v1(128.4,76.33)
PA9: length 72.9
  Top Layer w0.254: KEY20.1 93.1,53.59 KEY15.1 116.84,49.53 116.84,63.94 v1(126.83,73.93) ; v1(128.4,75.44) 128.53,75.31 U1.30
  Bottom Layer w0.254: v1(126.83,73.93) 126.88,73.93 v1(128.4,75.44)
PA11_USBDM: length 15.2
  Top Layer w0.254: U1.32 128.99,74.31 128.94,74.26 128.68,74.26 127.04,75.9 127.04,77.3 125.16,79.19 123.76,79.19 122.06,80.89 122.06,83.84 122.56,84.34 R7.1
PA12_USBDP: length 18.4
  Top Layer w0.254: v1(131.49,74.41) 130.89,73.81 U1.33 128.86,73.81 128.81,73.85 128.39,73.85 121.53,80.72 121.53,83.84 R8.1
  Bottom Layer w0.254: v1(131.49,74.41) 132.56,74.41 R9.2
+5V: length 54.2
  Top Layer w0.254: USB1.11 126.63,89.8 126.87,90.04 126.87,90.55 126.37,91.06 124.08,91.06 123.57,90.55 121.54,90.55 121.41,90.68 121.41,91.82 122.43,92.84 123.19,92.84 123.32,92.71 134.87,92.71 138.81,96.65 141.6,96.65 141.73,96.52 C1.2 ; USB1.2 131.43,89.82 131.11,90.14 131.11,90.73 131.32,90.93 132.36,90.93 132.49,91.06 134.58,91.06 134.71,90.93 138.05,90.93 138.68,91.57 140.72,91.57 141.8,92.65 C2.2
  Top Layer w0.508: C2.2 143.69,93.22 U2.3 144.03,93.56 144.8,93.56 145.16,93.92 145.16,94.99 144.72,95.44 U2.1 ; C1.2 143.73,95.61 144.01,95.34
NRST: length 15.5
  Top Layer w0.254: U1.7 140.46,75.31 140.97,75.82 140.97,79.44 SW1.2 142.62,83.38 C12.2 144.46,84.77 144.65,84.58
PA6: length 210.5
  Top Layer w0.254: KEY17.1 35.44,54.99 KEY12.1 40.26,44.83 54.23,30.86 58.93,30.86 58.93,15.24 60.83,13.34 88.91,13.34 90.68,11.56 ; 35.65,68.71 52.16,85.22 124.08,85.22 131.7,77.6 135,77.6 135.38,77.98 135.38,79.29 U1.16
PA7: length 200.4
  Top Layer w0.254: KEY18.1 54.74,55.05 KEY13.1 59.86,43.65 72.64,30.86 KEY8.1 78.49,26.28 82.04,22.73 120.89,22.73 KEY3.1 142.52,30.63 150.62,38.74 150.62,82.04 147.19,85.47 138.94,85.47 134.87,81.41 134.87,79.32 U1.17
PA13_SWDIO: length 36.5
  Top Layer w0.254: U1.34 127.16,73.31 126.62,72.77 126.62,66.93 135,58.55 146.94,58.55 H1.3
PA14_SWCLK: length 22.3
  Top Layer w0.254: U1.37 131.36,68.03 135.89,63.5 146.18,63.5 146.81,62.87 H1.2
$1N879: length 6.9
  Top Layer w0.254: 122.56,91.31 122.81,91.57 126.75,91.57 127.28,91.03 USB1.10
$1N949: length 7.2
  Top Layer w0.254: USB1.4 130.28,90.91 130.94,91.57 135.54,91.57
$2N2321: length 3
  Bottom Layer w0.254: KEY16.2 D1.2
$2N2416: length 2.5
  Bottom Layer w0.254: KEY17.2 D8.2
$2N2432: length 2.8
  Bottom Layer w0.254: KEY12.2 D7.2
$2N2438: length 2.7
  Bottom Layer w0.254: KEY11.2 D2.2
$2N2444: length 2.7
  Bottom Layer w0.254: KEY6.2 D3.2
$2N2450: length 2.6
  Bottom Layer w0.254: KEY1.2 16.42,14.22 D4.2
$2N2455: length 2.6
  Bottom Layer w0.254: KEY2.2 99.48,14.1 D5.2
$2N2482: length 2.6
  Bottom Layer w0.254: KEY7.2 67.73,33.4 67.86,33.27
$2N2538: length 2.9
  Bottom Layer w0.254: KEY18.2 63.67,71.5 D9.2
$2N2571: length 2.4
  Bottom Layer w0.254: 66.2,52.47 68.6,52.47 D10.2
$2N2603: length 2.6
  Bottom Layer w0.254: KEY8.2 87.29,33.4 D11.2
$2N2624: length 2.9
  Bottom Layer w0.254: KEY3.2 137.86,33.17 D12.2
$2N2648: length 2.6
  Bottom Layer w0.254: KEY4.2 D13.2
$2N2677: length 2.8
  Bottom Layer w0.254: KEY9.2 105.96,33.27 D14.2
$2N2714: length 2.5
  Bottom Layer w0.254: KEY14.2 87.5,51.56
$2N2748: length 2.4
  Bottom Layer w0.254: KEY19.2 82.21,71.12 82.59,70.74
$2N2794: length 3
  Bottom Layer w0.254: KEY10.2 126.03,52.07 D19.2
$2N2817: length 3.1
  Bottom Layer w0.254: KEY15.2 106.55,52.07
$2N2829: length 2.4
  Bottom Layer w0.254: KEY20.2 101.64,71.37 D17.2

## Copper pours and planes (outline as drawn; the poured copper is in the pictures)
GND on Top Layer: -5.33,106.81 157.1,106.81 157.1,-4.83 -5.33,-4.83
GND on Bottom Layer: -11.18,98.43 164.59,98.43 164.59,-28.7 -11.18,-28.7
